# Altium schematic sheet Sensors.SchDoc
size A4
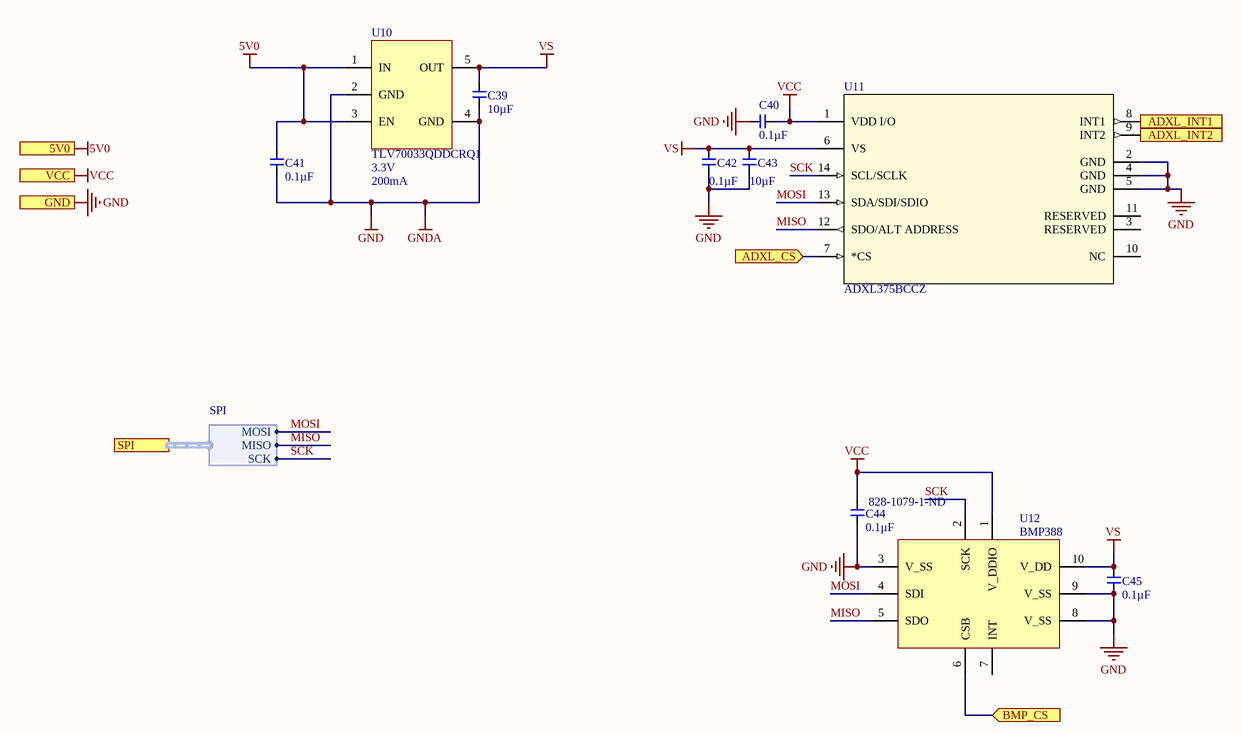
[diagram p0: Sensors.SchDoc]

## Parts
C39  Capacitance (shorthand): 10µF  [C0603]  (hidden comment: __template_cap)
C40  Capacitance (shorthand): 0.1µF  [C0603]  (hidden comment: __template_cap)
C41  Capacitance (shorthand): 0.1µF  [C0603]  (hidden comment: __template_cap)
C42  Capacitance (shorthand): 0.1µF  [C0603]  (hidden comment: __template_cap)
C43  Capacitance (shorthand): 10µF  [C0603]  (hidden comment: __template_cap)
C44  Capacitance (shorthand): 0.1µF  [C0603]  (hidden comment: __template_cap)
C45  Capacitance (shorthand): 0.1µF  [C0603]  (hidden comment: __template_cap)
U10  Manufacturer Part Number: TLV70033QDDCRQ1  Voltage - Output: 3.3V  Current - Output: 200mA  [5SOT23]  (hidden comment: LDO_TLV70033QDDCRQ1)
U11  ADXL375BCCZ  [LGA_CC-14-1]
U12  BMP388  Supplier Part Number 1: 828-1079-1-ND  [8 pin LGA]

## Ports
5V0 (in), ADXL_CS (in), ADXL_INT1 (out), ADXL_INT2 (out), BMP_CS (in), GND (in), SPI (harness SPI), VCC (in)

## Harnesses
SPI: MISO, MOSI, SCK

## Nets
5V0: C41.1 U10.1(IN) U10.3(EN) ; port 5V0
GND: C39.2 C40.2 C41.2 C42.1 C43.2 C44.2 C45.2 U10.2(GND) U10.4(GND) U11.2(GND) U11.4(GND) U11.5(GND) U12.3(V_SS) U12.8(V_SS) U12.9(V_SS) ; port GND  [also labelled GNDA]
VCC: C40.1 C44.1 U11.1(VDD_I/O) U12.1(V_DDIO) ; port VCC
VS: C39.1 C42.2 C43.1 C45.1 U10.5(OUT) U11.6(VS) U12.10(V_DD)
ADXL_CS: U11.7(*CS) ; port ADXL_CS
ADXL_INT1: U11.8(INT1) ; port ADXL_INT1
ADXL_INT2: U11.9(INT2) ; port ADXL_INT2
BMP_CS: U12.6(CSB) ; port BMP_CS
MISO: U11.12(SDO/ALT_ADDRESS) U12.5(SDO) ; port SPI.MISO
MOSI: U11.13(SDA/SDI/SDIO) U12.4(SDI) ; port SPI.MOSI
SCK: U11.14(SCL/SCLK) U12.2(SCK) ; port SPI.SCK

Not connected (* = marked no-connect by the designer): U11 3(RESERVED) 10(NC) 11(RESERVED); U12 7(INT)

## Notes on the sheet
- Title
- Size:
- Date:
- A4
- Number:
- Time:
- Revision:
- Sheet
- of
- File:

## Library data of the parts
C39 C43 = 490-13248-1-ND: CAP CER 10UF 35V X5R 0603 20%; Manufacturer: Murata Electronics North America; Capacitance - pF (Machine readable): #NAME?; type: capacitor; Dielectric: X5R; Supplier 1: Digikey; Supplier Part Number 1: 490-13248-1-ND; Rated Voltage: 35V
C40-C42 C44 C45 = 490-1519-1-ND: CAP CER 0603 0.1µF X7R 50V 10%; Manufacturer: Murata Electronics North America; Capacitance - pF (Machine readable): #NAME?; type: capacitor; Dielectric: X7R; Supplier 1: Digikey; Supplier Part Number 1: 490-1519-1-ND; Rated Voltage: 50V
U10 = LDO_TLV70033QDDCRQ1: IC REG LDO 3.3V .2A SOT23-5; Manufacturer: Texas Instruments; Regulator Topology: Positive Fixed; Number of Regulators: 1; Voltage - Input: Up to 5.5V; Current - Limit (Min): 220mA; ComponentLink1URL: http://www.ti.com/lit/ds/symlink/tlv70033-q1.pdf; ComponentLink1Description: Datasheet; Supplier 1: Digi-Key; RoHS: RoHS Compliant; Category: Integrated Circuits (ICs); Stock 1: 889; Pricing 1: 1=0.58, 10=0.507, 25=0.444, 100=0.1661, 250=0.16296, 500=0.1599, 750=0.15683 (USD); Packaging: Cut Tape (CT); Voltage - Dropout (Typical): -; Operating Temperature: -40°C ~ 125°C; Mounting Type: Surface Mount; Package / Case: SOT-23-5 Thin, TSOT-23-5; Supplier Device Package: SOT-5; Supplier Part Number 1: 296-27780-1-ND
U11 = ADXL375BCCZ: 200G Accelcerometer; Manufacturer: Analog Devices; Manufacturer Part Number: ADXL375BCCZ-RL7; Bandwidth: 1kHz; Interface: I2C,SPI; Nominal Supply Current: 145uA; -3db Bandwidth: 1.6kHz; Output Type: Digital; Axis: X, Y, Z; Sensitivity: 20.5LSB/g; Operating Supply Voltage: 3.6V; Value: Value; Type: Type; RefDes: RefDes; ComponentLink1Description: Datasheet; ComponentLink1URL: http://www.analog.com/media/en/technical-documentation/data-sheets/ADXL375.PDF; Supplier 1: Digi-Key; Stock 1: 3410; Pricing 1: 1=10.9, 10=10.021, 100=8.463, 500=7.5284 (USD); Mount: Surface Mount; Number of Pins: 14; Min Operating Temperature: -40°C; Max Operating Temperature: 85°C; Package Quantity: 1; Operating Supply Current: 145uA; Lead Free: Contains Lead; Supplier Part Number 1: ADXL375BCCZ-RL7CT-ND
U12 = BMP388: SENSOR PRESSURE ABS; Manufacturer: Bosch Sensortec; Supplier 1: Digi-Key; Manufacturer Part Number: BMP388; Stock 1: 46050; Pricing 1: 1=3.93, 5=3.466, 10=3.061, 25=2.4832, 50=2.1946, 100=2.1368, 500=1.7903, 1000=1.6748, 5000=1.5593 (USD); ComponentLink1URL: https://ae-bst.resource.bosch.com/media/_tech/media/product_flyer/BST-BMP388-FL000-00.pdf; ComponentLink1Description: https://ae-bst.resource.bosch.com/media/_tech/media/product_flyer/BST-BMP388-FL000-00.pdf